# Altium schematic sheet RemoteMain.SchDoc
size A4; Author: Ben Bowden, Jesse Mocilac, Tayla Bender, Rothon Browne; CompanyName: James Cook University; DrawnBy1: Ben Bowden, Jesse Mocilac, Tayla Bender, Rothon Browne; Organization: James Cook University; Title1: CC3501 Baby Monitor; SheetNumber: 1; SheetTotal: 4; ProjectName: *ProjectName
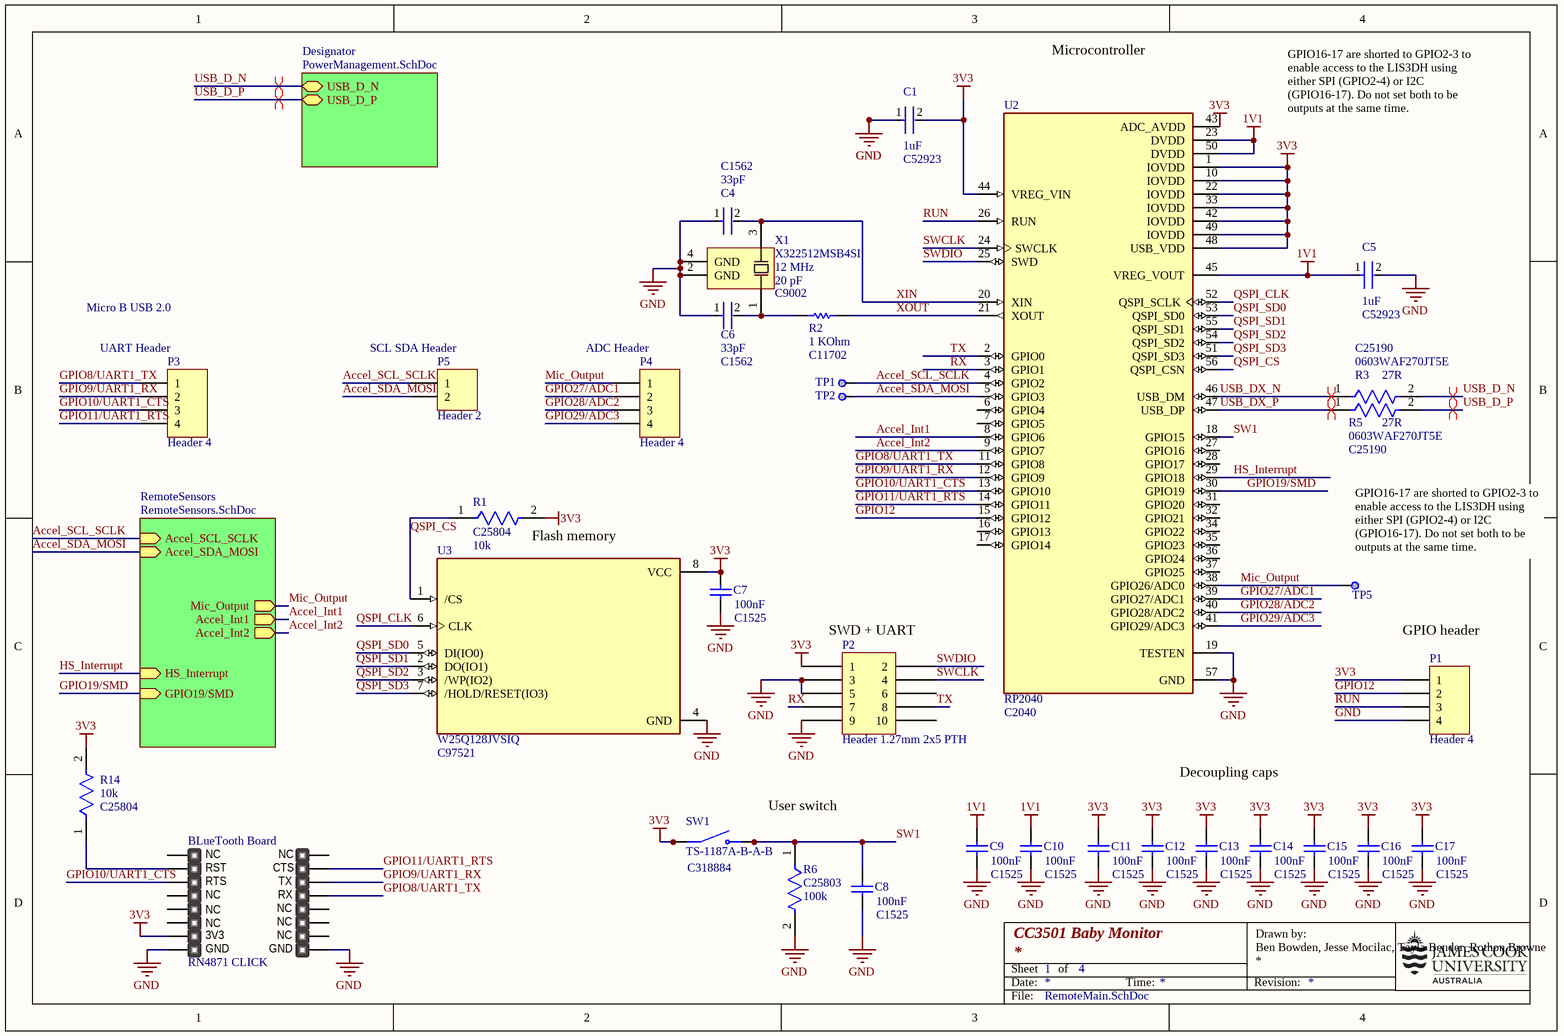
[diagram p0: RemoteMain.SchDoc]

## Parts
BLueTooth_Board  RN4871 CLICK  [mikroBUS - Large]  (no BOM)
C1  JLCPCB Part: C52923  Capacitance: 1uF  [FP-CL542-IPC_C]  (hidden comment: CL05A105KA5NQNC)
C4  JLCPCB Part: C1562  Capacitance: 33pF  [FP-0402-L_1_0_1-W_0_5_0_1-IPC_A]  (hidden comment: 0402CG330J500NT)
C5  JLCPCB Part: C52923  Capacitance: 1uF  [FP-CL542-IPC_C]  (hidden comment: CL05A105KA5NQNC)
C6  JLCPCB Part: C1562  Capacitance: 33pF  [FP-0402-L_1_0_1-W_0_5_0_1-IPC_A]  (hidden comment: 0402CG330J500NT)
C7  JLCPCB Part: C1525  Capacitance: 100nF  [CAPC1050X55X23ML05T13]  (hidden comment: CL05B104KO5NNNC)
C8  JLCPCB Part: C1525  Capacitance: 100nF  [CAPC1050X55X23ML05T13]  (hidden comment: CL05B104KO5NNNC)
C9  JLCPCB Part: C1525  Capacitance: 100nF  [CAPC1050X55X23ML05T13]  (hidden comment: CL05B104KO5NNNC)
C10  JLCPCB Part: C1525  Capacitance: 100nF  [CAPC1050X55X23ML05T13]  (hidden comment: CL05B104KO5NNNC)
C11  JLCPCB Part: C1525  Capacitance: 100nF  [CAPC1050X55X23ML05T13]  (hidden comment: CL05B104KO5NNNC)
C12  JLCPCB Part: C1525  Capacitance: 100nF  [CAPC1050X55X23ML05T13]  (hidden comment: CL05B104KO5NNNC)
C13  JLCPCB Part: C1525  Capacitance: 100nF  [CAPC1050X55X23ML05T13]  (hidden comment: CL05B104KO5NNNC)
C14  JLCPCB Part: C1525  Capacitance: 100nF  [CAPC1050X55X23ML05T13]  (hidden comment: CL05B104KO5NNNC)
C15  JLCPCB Part: C1525  Capacitance: 100nF  [CAPC1050X55X23ML05T13]  (hidden comment: CL05B104KO5NNNC)
C16  JLCPCB Part: C1525  Capacitance: 100nF  [CAPC1050X55X23ML05T13]  (hidden comment: CL05B104KO5NNNC)
C17  JLCPCB Part: C1525  Capacitance: 100nF  [CAPC1050X55X23ML05T13]  (hidden comment: CL05B104KO5NNNC)
P1  Header 4  [HDR1X4]
P2  Header 1.27mm 2x5 PTH  [Header 1.27mm 2x5 PTH]
P3  Header 4  [HDR1X4]
P4  Header 4  [HDR1X4]
P5  Header 2  [HDR1X2]
R1  JLCPCB Part: C25804  Resistance: 10k  [FP-CRCW0603-e3-IPC_B]  (hidden comment: 0603WAF1002T5E)
R2  Resistance: 1 KOhm  JLCPCB Part: C11702  [RESC1005X40X25NL05T05]  (hidden comment: 0402WGF1001TCE)
R3  0603WAF270JT5E  JLCPCB Part: C25190  Resistance: 27R  [FP-CRCW0603-e3-IPC_B]
R5  0603WAF270JT5E  JLCPCB Part: C25190  Resistance: 27R  [FP-CRCW0603-e3-IPC_B]
R6  JLCPCB Part: C25803  Resistance: 100k  [FP-CRCW0603-e3-IPC_B]  (hidden comment: 0603WAF1003T5E)
R14  JLCPCB Part: C25804  Resistance: 10k  [FP-CRCW0603-e3-IPC_B]  (hidden comment: 0603WAF1002T5E)
SW1  TS-1187A-B-A-B  JLCPCB Part: C318884  [SW_TS-1187A-B-A-B]
TP1  Test point  [Test point-Footprint-1]  (value not drawn)  (no BOM)
TP2  Test point  [Test point-Footprint-1]  (value not drawn)  (no BOM)
TP5  Test point  [Test point-Footprint-1]  (value not drawn)  (no BOM)
U2  RP2040  JLCPCB Part: C2040  [QFN40P700X700X90-57N]
U3  W25Q128JVSIQ  JLCPCB Part: C97521  [SOIC127P790X216-8N]
X1  X322512MSB4SI  Frequency: 12 MHz  Load capacitance: 20 pF  JLCPCB Part: C9002  [X322512MSB4SI-Footprint-1]

## Sub-sheets
Designator = PowerManagement.SchDoc: USB_D_N (bidir), USB_D_P (bidir)
RemoteSensors = RemoteSensors.SchDoc: Accel_SCL_SCLK (in), Accel_SDA_MOSI (in), Accel_Int2 (out), Accel_Int1 (out), Mic_Output (out), HS_Interrupt (in), GPIO19/SMD (in)

## Nets
1V1: C5.1 C9.2 C10.2 U2.23(DVDD) U2.45(VREG_VOUT) U2.50(DVDD)
3V3: BLueTooth_Board.7(3.3V) C1.2 C7.2 C11.2 C12.2 C13.2 C14.2 C15.2 C16.2 C17.2 P1.1 P2.1 R1.2 R14.2 SW1.A(COM) SW1.B(COM) U2.1(IOVDD) U2.10(IOVDD) U2.22(IOVDD) U2.33(IOVDD) U2.42(IOVDD) U2.43(ADC_AVDD) U2.44(VREG_VIN) U2.48(USB_VDD) U2.49(IOVDD) U3.8(VCC)
GND: BLueTooth_Board.8(GND) BLueTooth_Board.9(GND) C1.1 C4.1 C5.2 C6.1 C7.1 C8.1 C9.1 C10.1 C11.1 C12.1 C13.1 C14.1 C15.1 C16.1 C17.1 P1.4 P2.3 P2.5 P2.9 R6.2 U2.19(TESTEN) U2.57(GND) U3.4(GND) X1.2(GND) X1.4(GND)
Accel_Int1: U2.8(GPIO6) ; sheet RemoteSensors/Accel_Int1
Accel_Int2: U2.9(GPIO7) ; sheet RemoteSensors/Accel_Int2
Accel_SCL_SCLK: P5.1 TP1.1 U2.4(GPIO2) ; sheet RemoteSensors/Accel_SCL_SCLK
Accel_SDA_MOSI: P5.2 TP2.1 U2.5(GPIO3) ; sheet RemoteSensors/Accel_SDA_MOSI
GPIO8/UART1_TX: BLueTooth_Board.13(TX) P3.1 U2.11(GPIO8)
GPIO9/UART1_RX: BLueTooth_Board.14(RX) P3.2 U2.12(GPIO9)
GPIO10/UART1_CTS: BLueTooth_Board.3(CS) P3.3 U2.13(GPIO10)
GPIO11/UART1_RTS: BLueTooth_Board.15(INT) P3.4 U2.14(GPIO11)
GPIO12: P1.2 U2.15(GPIO12)
GPIO19/SMD: U2.30(GPIO19) ; sheet RemoteSensors/GPIO19/SMD
GPIO27/ADC1: P4.2 U2.39(GPIO27/ADC1)
GPIO28/ADC2: P4.3 U2.40(GPIO28/ADC2)
GPIO29/ADC3: P4.4 U2.41(GPIO29/ADC3)
HS_Interrupt: U2.29(GPIO18) ; sheet RemoteSensors/HS_Interrupt
Mic_Output: P4.1 TP5.1 U2.38(GPIO26/ADC0) ; sheet RemoteSensors/Mic_Output
QSPI_CLK: U2.52(QSPI_SCLK) U3.6(CLK)
QSPI_CS: R1.1 U2.56(QSPI_CSN) U3.1(/CS)
QSPI_SD0: U2.53(QSPI_SD0) U3.5(DI(IO0))
QSPI_SD1: U2.55(QSPI_SD1) U3.2(DO(IO1))
QSPI_SD2: U2.54(QSPI_SD2) U3.3(/WP(IO2))
QSPI_SD3: U2.51(QSPI_SD3) U3.7(/HOLD/RESET(IO3))
RUN: P1.3 U2.26(RUN)
RX: P2.7 U2.3(GPIO1)
SW1: C8.2 R6.1 SW1.C(NO) SW1.D(NO) U2.18(GPIO15)
SWCLK: P2.4 U2.24(SWCLK)
SWDIO: P2.2 U2.25(SWD)
TX: P2.8 U2.2(GPIO0)
USB_D_N: R3.2 ; sheet Designator/USB_D_N
USB_D_P: R5.2 ; sheet Designator/USB_D_P
USB_DX_N: R3.1 U2.46(USB_DM)
USB_DX_P: R5.1 U2.47(USB_DP)
XIN: C4.2 U2.20(XIN) X1.3(OSC2)
XOUT: R2.2 U2.21(XOUT)
NetBLueTooth_Board_2: BLueTooth_Board.2(RST) R14.1
NetC6_2: C6.2 R2.1 X1.1(OSC1)

Not connected (* = marked no-connect by the designer): BLueTooth_Board 1(AN) 4(SCK) 5(MISO) 6(MOSI) 10(5V) 11(SDA) 12(SCL) 16(PWM); P2 6 10; U2 6(GPIO4) 7(GPIO5) 16(GPIO13) 17(GPIO14) 27(GPIO16) 28(GPIO17) 31(GPIO20) 32(GPIO21) 34(GPIO22) 35(GPIO23) 36(GPIO24) 37(GPIO25)

## Layout directives
differential pair: USB_D_N, USB_D_P, USB_DX_N, USB_DX_P

## Notes on the sheet
- Microcontroller
- GPIO16-17 are shorted to GPIO2-3 to enable access to the LIS3DH using either SPI (GPIO2-4) or I2C (GPIO16-17). Do not set both to be outputs at the same time.
- Micro B USB 2.0
- (near P3) UART Header
- (near P5) SCL SDA Header
- (near P4) ADC Header
- Flash memory
- (near TP5) GPIO16-17 are shorted to GPIO2-3 to enable access to the LIS3DH using either SPI (GPIO2-4) or I2C (GPIO16-17). Do not set both to be outputs at the same time.
- (near P2) SWD + UART
- GPIO header
- Decoupling caps
- User switch
- Date:
- Sheet
- of
- Time:
- Revision:
- Drawn by:
- File:
- (in symbol CMP-011-00000-2) NC; CTS; RTS; 3V3

## Library data of the parts
BLueTooth_Board = CMP-011-00000-2: mikroBUS compatible add-on board; Design Item ID: mikroBUS compatible add-on board; Source: mikroBUS_Add-on_standard.SchLib
C1 C5 = CMP-00005-3: Cap Ceramic 1uF 25V X5R ±10% SMD 0402 +85°C Paper T/R; Case Code (Imperial): 0402; Thickness: 0.022inch; Material: Ceramic; Length: 1mm; Voltage Rating: 25V; Lead Free: Lead Free; Package Quantity: 10000; Min Operating Temperature: -55°C; Radiation Hardening: No; Case/Package: 0402; Case Code (Metric): 1005; Height: 0.5mm; Width: 0.02inch; Mount: Surface Mount; Dielectric: X5R; Tolerance: 10%; Depth: 0.5mm; Max Operating Temperature: 85°C; Packaging: Tape and Reel
C4 C6 = CMP-00008-5: General Purpose Ceramic Capacitor, 0402, 33pF, 5%, C0G, 30ppm/°C, 50V; Insulation Resistance: 100GR; RoHS Compliant: Yes; REACH SVHC: No SVHC; Package Quantity: 1; Voltage Rating (DC): 50V; Voltage: 50V; Length: 1mm; Number of Pins: 2; Case Code (Imperial): 0402; Mount: Surface Mount; Min Operating Temperature: -55°C; Radiation Hardening: No; Max Operating Temperature: 125°C; Contact Plating: Tin; Case/Package: 0402; Thickness: 0.022inch; Height: 0.5mm; Construction: Flat; Tolerance: 5%; Depth: 0.5mm; Case Code (Metric): 1005; Series: -; Temperature Coefficient: 30ppm/°C; Lead Free: Lead Free; Voltage Rating: 50V; Packaging: Tape and Reel; Width: 0.5mm; Dielectric: C0G; Termination: SMD/SMT
C7-C17 = CMP-00007-3: Chip Capacitor, 100 nF, +/- 10%, 16 V, -55 to 125 degC, 0402 (1005 Metric), RoHS, Tape and Reel; Manufacturer: Samsung Electro-Mechanics; Dielectric: X7R; Rated Voltage: 16V; Manufacturer URL: http://www.samsungsem.com/global/index.jsp; Case Size/Dimension: 0402; Tolerance (%): ±10%; Datasheet Version: Nov-10; Datasheet URL: https://datasheet.ciiva.com/29198/458718-da-01-en-vs-kondensator-0402-29198423.pdf
P1 P3 P4 = CMP-002-00124-1: Header, 4-Pin; Signal Integrity: Connector; LatestRevisionNote: Re-released for DXP Platform.; Component Type: Standard; Design Item ID: Header 4; Source: Miscellaneous Connectors.SchLib; Pin Count: 4; Publisher: Altium Limited; LatestRevisionDate: 17-Jul-2002
P2 = CMP-005-0002-2: Header 1.27mm pitch, 2x5, PTH through hole; Pins: 10; element14 Item: 1577743; Design Item ID: Header 1.27mm 2x5 PTH; Source: JCULibrary.SchLib; Component Type: Standard
P5 = CMP-002-00097-1: Header, 2-Pin; Signal Integrity: Connector; LatestRevisionDate: 17-Jul-2002; Publisher: Altium Limited; Pin Count: 2; Design Item ID: Header 2; LatestRevisionNote: Re-released for DXP Platform.; Source: Miscellaneous Connectors.SchLib; Component Type: Standard
R1 R14 = CMP-009-0009-1: RES Thick Film, 10kΩ, 1%, 0.1W, 100ppm/°C, 0603; Voltage Rating: 75V; Power Rating: 100mW; Composition: Thick Film; Military Standard: Not; Temperature Coefficient: 100ppm/°C; Length: 1.55mm; Tolerance: 1%; Lead Free: Lead Free; Max Operating Temperature: 155°C; Number of Pins: 2; Width: 0.85mm; Termination: SMD/SMT; Packaging: Tape and Reel; Weight: 7.1E-05oz; Radiation Hardening: No; Voltage Rating (DC): 75V; Height: 0.45mm; Min Operating Temperature: -55°C; Mount: Surface Mount; Contact Plating: Tin; Case Code (Metric): 1608; Case Code (Imperial): 0603; Depth: 0.85mm; Case/Package: 0603; Package Quantity: 5000
R2 = CMP-009-0000-2: Chip Resistor, 1 KOhm, +/- 1%, 100 mW, -55 to 155 degC, 0402 (1005 Metric), RoHS, Tape and Reel; Manufacturer: Basic Passives; Power Rating: 100 mW; Case\/Package: 0402; Voltage Rating: 50 V; RoHSCompliant: true; Mount: Surface Mount; Length: 1 mm; Height: 0.35 mm; Pins: 2; Case Code (Imperial): 0402; PackageDescription: 2-Pin Surface Mount Device, Body 1 x 0.5 mm; Radiation Hardening: No; Width: 0.5 mm; Mounting Technology: Surface Mount; PackageReference: 0402; Case Code (Metric): 1005; Packaging: Tape and Reel; Max Operating Temperature: 155 degC; PartNumber: 0402WGF1001TCE; Package Quantity: 10000; Min Operating Temperature: -55 degC; Tolerance: 1%; REACH SVHC: Yes
R3 R5 = CMP-00004-5: RES Thick Film, 27Ω, 1%, 0.1W, 200ppm/°C, 0603; Power Rating: 100mW; Temperature Coefficient: 100ppm/°C; Voltage Rating: 75V; Length: 1.55mm; Radiation Hardening: No; Width: 0.85mm; Case Code (Metric): 1608; Composition: Thick Film; Max Operating Temperature: 155°C; Number of Pins: 2; Contact Plating: Tin; Weight: 7.1E-05oz; Case Code (Imperial): 0603; Min Operating Temperature: -55°C; Mount: Surface Mount; Height: 0.45mm; Package Quantity: 5000; Military Standard: Not; Voltage Rating (DC): 75V; Packaging: Tape and Reel; Lead Free: Lead Free; Depth: 0.85mm; Termination: SMD/SMT; Case/Package: 0603; Tolerance: 1%
R6 = CMP-009-0004-3: RES Thick Film, 100kΩ, 1%, 0.1W, 100ppm/°C, 0603; Power Rating: 100mW; Voltage Rating: 75V; Mount: Surface Mount; Number of Pins: 2; Depth: 0.85mm; Case/Package: 0603; Composition: Thick Film; Max Operating Temperature: 155°C; Case Code (Metric): 1608; Contact Plating: Tin; Temperature Coefficient: 100ppm/°C; Weight: 7.1E-05oz; Height: 0.45mm; Termination: SMD/SMT; Tolerance: 1%; Min Operating Temperature: -55°C; Lead Free: Lead Free; Voltage Rating (DC): 75V; Case Code (Imperial): 0603; Length: 1.55mm; Packaging: Tape and Reel; Package Quantity: 5000; Radiation Hardening: No; Width: 0.85mm; Military Standard: Not
SW1 = CMP-051-000000-5: SPST 50mA @ 12VDC Top Actuated Round Button 160gf SMD Tactile Switches RoHS; Source: TS-1187A-B-A-B.SchLib; Package: None; Availability: Unavailable; MP: TS-1187A-B-A-B; Value: *; Price: None; Pin Count: 4; Component Type: Standard; Design Item ID: TS-1187A-B-A-B
TP1 TP2 TP5 = CMP-004-0001-1: Test point for in-circuit debugging (0.3mm hole, 0.7mm diameter)
U2 = CMP-043-000000-5: ARM Cortex-M0+ MCU 32-Bit Microcontroller for Raspberry Pi Pico; Design Item ID: RP2040; Price: None; Component Type: Standard; Package: None; Availability: Available; Value: *; Pin Count: 57; Source: RP2040.SchLib; MP: RP2040
U3 = CMP-031-00006-4: FLASH - NOR Memory IC 128Mb (16M x 8) SPI - Quad I/O, QPI, DTR 133 MHz 8-SOIC; MF: Winbond Electronics; MP: W25Q128JVSIQ; Design Item ID: W25Q128JVSIQ; Check_prices: https://www.snapeda.com/parts/W25Q128JVSIQ/Winbond+Electronics/view-part/?ref=eda; Price: None; Purchase-URL: https://pricing.snapeda.com/search/part/W25Q128JVSIQ/?ref=eda; Pin Count: 8; Package: SOIC-8 Winbond; Availability: In Stock; Source: W25Q128JVSIQ.SchLib; Value: *; SnapEDA_Link: https://www.snapeda.com/parts/W25Q128JVSIQ/Winbond+Electronics/view-part/?ref=snap; Component Type: Standard
X1 = CMP-00002-4: 12MHz SMD Crystal Resonator 20pF ±10ppm ±30ppm -40℃~+85℃ SMD3225-4P  Crystals ROHS Yangxing Tech; Max ESR: 80 Ω